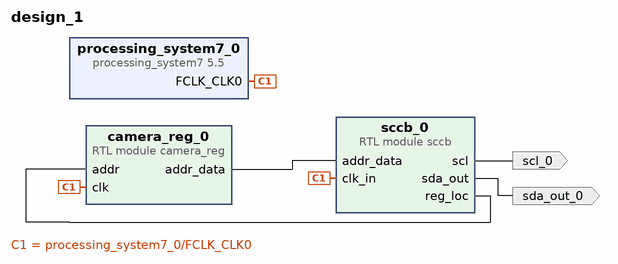
[diagram p0: block diagram of the top level]
# Vivado block design design_1, xc7z020clg400-1, Vivado 2017.4
create_bd_design design_1

create_bd_port -dir O scl_0
create_bd_port -dir O sda_out_0

create_bd_cell -type ip -vlnv xilinx.com:ip:processing_system7:5.5 processing_system7_0
set_property -dict {CONFIG.PCW_FPGA0_PERIPHERAL_FREQMHZ 24 CONFIG.PCW_USE_M_AXI_GP0 0} [get_bd_cells processing_system7_0]
# 29 more settings of processing_system7_0 are not shown: defaults, MIO pin electricals, DDR timing, and values the tool derives
create_bd_cell -type module -reference sccb sccb_0
create_bd_cell -type module -reference camera_reg camera_reg_0

# ---- connections ----

connect_bd_net [get_bd_pins camera_reg_0/addr_data] [get_bd_pins sccb_0/addr_data]
connect_bd_net [get_bd_pins sccb_0/reg_loc] [get_bd_pins camera_reg_0/addr]
connect_bd_net [get_bd_pins sccb_0/scl] [get_bd_ports scl_0]
connect_bd_net -net clk_div_0_clk_out [get_bd_pins processing_system7_0/FCLK_CLK0] [get_bd_pins sccb_0/clk_in] [get_bd_pins camera_reg_0/clk]
connect_bd_net [get_bd_pins sccb_0/sda_out] [get_bd_ports sda_out_0]

validate_bd_design
save_bd_design
